# EAGLE design InterlockAdapter (EAGLE 6.4)
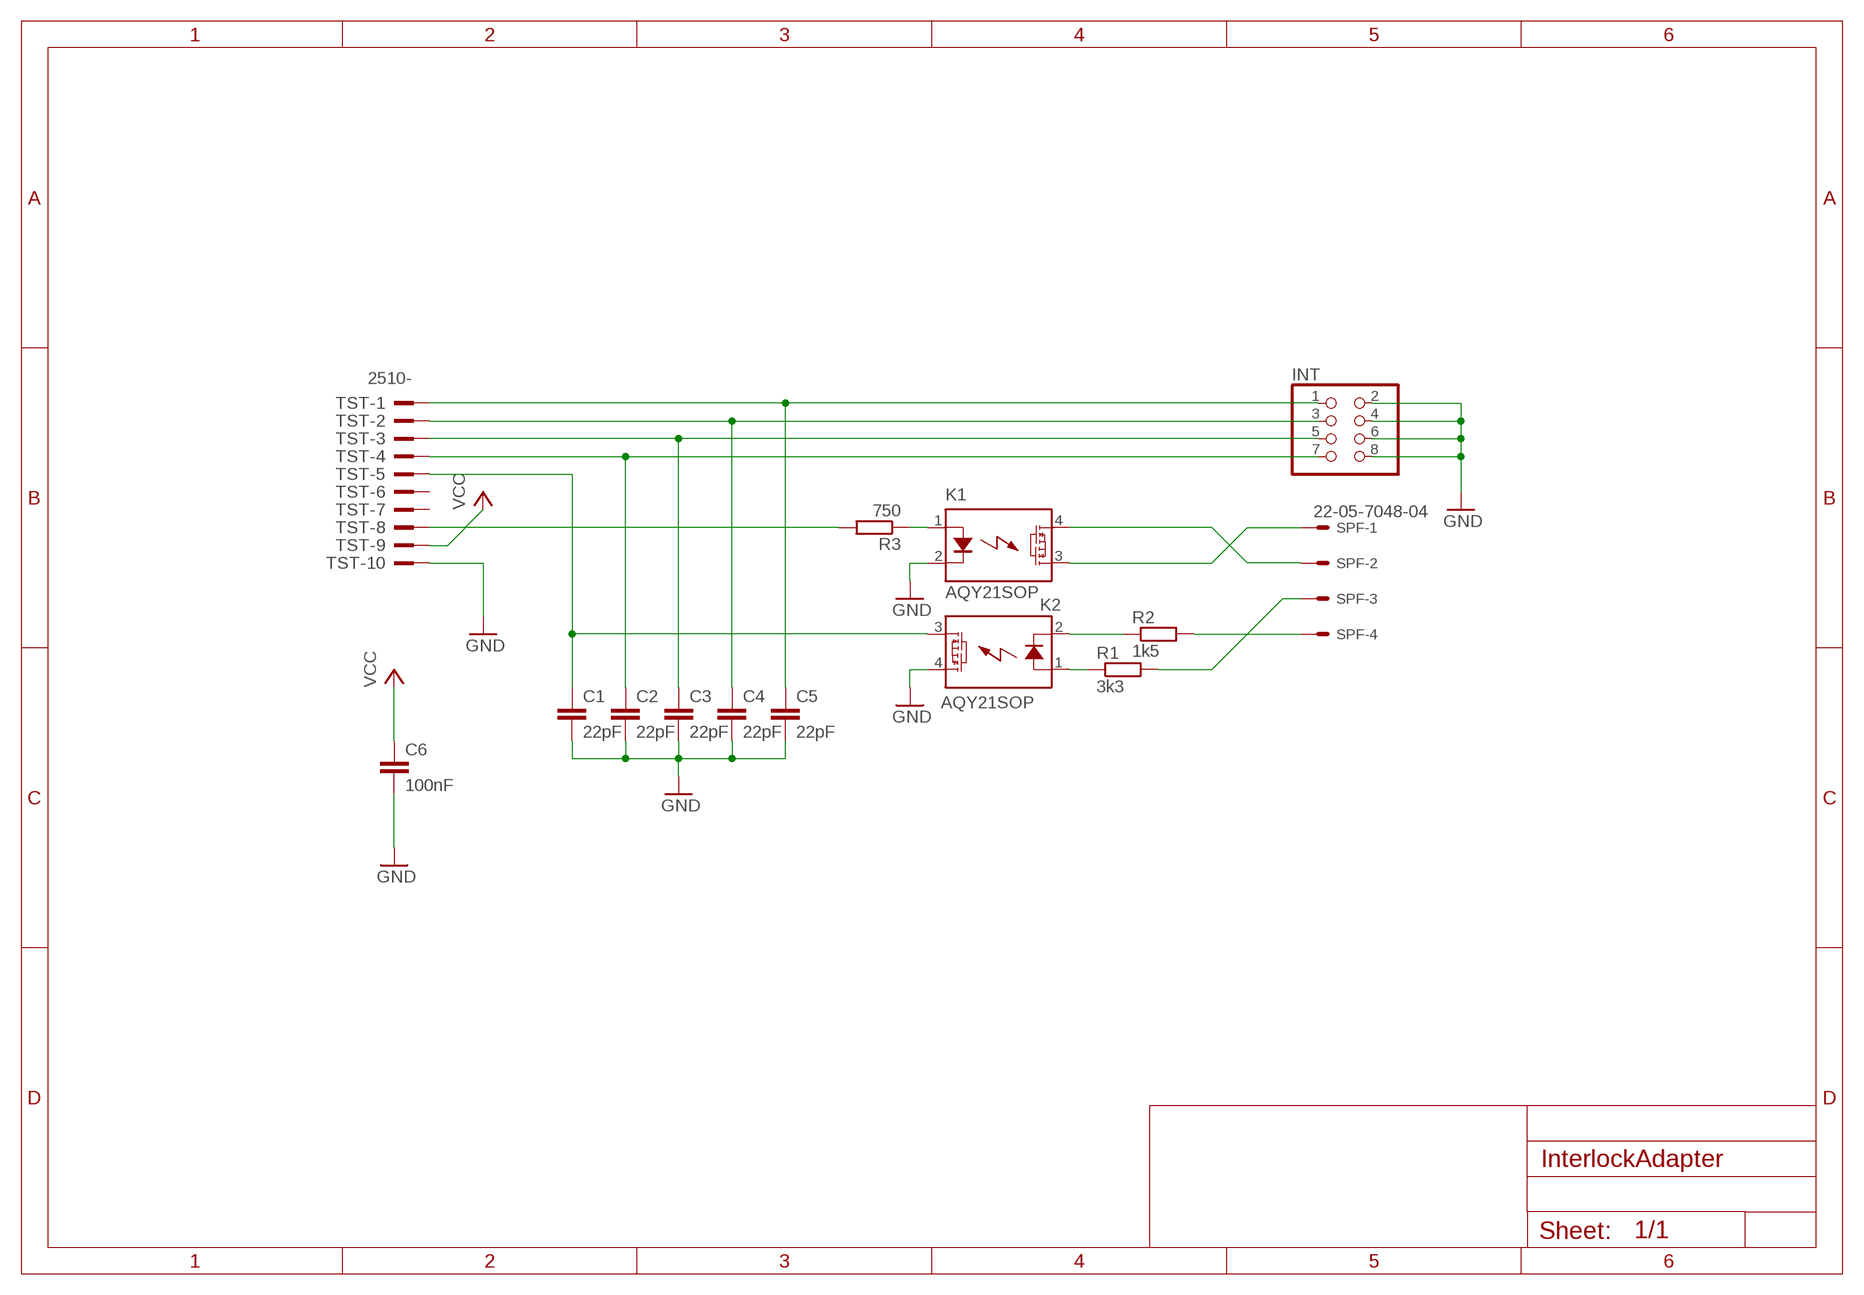
[diagram p0: schematic, sheet 1]

## Parts
C1  22pF  C-EUC1206K  [C1206K]
C2  22pF  C-EUC1206K  [C1206K]
C3  22pF  C-EUC1206K  [C1206K]
C4  22pF  C-EUC1206K  [C1206K]
C5  22pF  C-EUC1206K  [C1206K]
C6  100nF  C-EUC1206K  [C1206K]
INT  PINHD-2X4/90  [2X04/90]
K1  AQY21SOP  [SOP04]
K2  AQY21SOP  [SOP04]
R1  3k3  R-EU_R1206  [R1206]
R2  1k5  R-EU_R1206  [R1206]
R3  750  R-EU_R1206  [R1206]
SPF  22-05-7048-04  [7395-04]
TST  2510-  [PAK100/2500-10]

## Nets
GND: C1.2 C2.2 C3.2 C4.2 C5.2 C6.2 INT.2 INT.4 INT.6 INT.8 K1.2(K) K2.4(DS1) TST.10
N$1: C5.1 INT.1 TST.1
N$2: C4.1 INT.3 TST.2
N$3: C3.1 INT.5 TST.3
N$4: C2.1 INT.7 TST.4
N$5: C1.1 K2.3(DS2) TST.5
N$6: K2.2(K) R2.1
N$7: K2.1(A) R1.1
N$8: K1.3(DS2) SPF.1
N$9: K1.4(DS1) SPF.2
N$10: R2.2 SPF.4
N$11: R1.2 SPF.3
N$12: K1.1(A) R3.1
N$13: R3.2 TST.8
VCC: C6.1 TST.9
Unconnected: TST.6 TST.7

## Library data of the parts
C1-C6 = rcl:C-EU: CAPACITOR, European symbol
INT = pinhead:PINHD-2X4: PIN HEADER
K1 K2 = relay:AQY*: PhotoMOS Relay NAiS Source: http://www.panasonic-electric-works.com/catalogues/downloads/photomos/ds_x615_en_aqz10_20.pdf; OC_FARNELL: unknown; OC_NEWARK: unknown
R1-R3 = rcl:R-EU_: RESISTOR, European symbol
SPF = con-molex:22-?-04: CONNECTOR wire to board 2.54 mm (.1 inch) pitch header; OC_FARNELL: unknown; OC_NEWARK: unknown
TST = con-3m:2510-: 3M (TM) Pak 100 4-Wall Header Source: 3M; MF: 3M; MPN: 2510-6002UB; OC_FARNELL: 9838244; OC_NEWARK: 46F4725

## Board
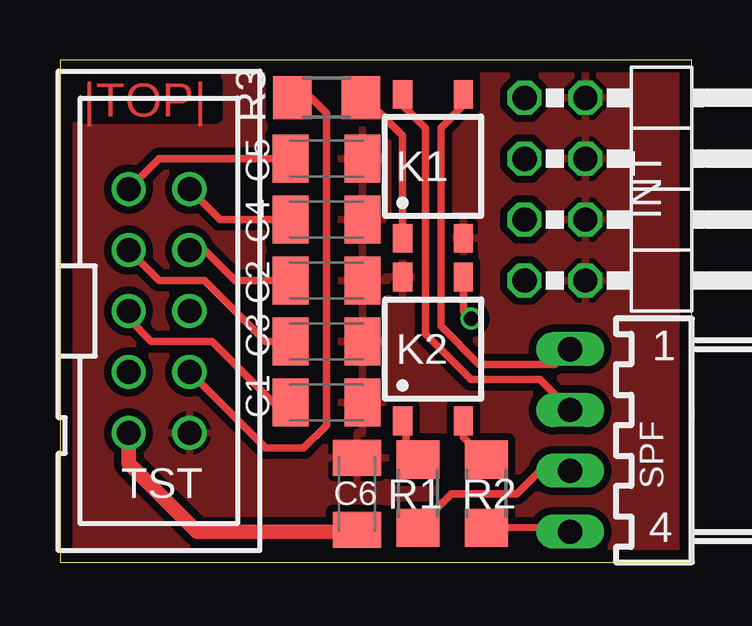
[diagram p1: board, top side]
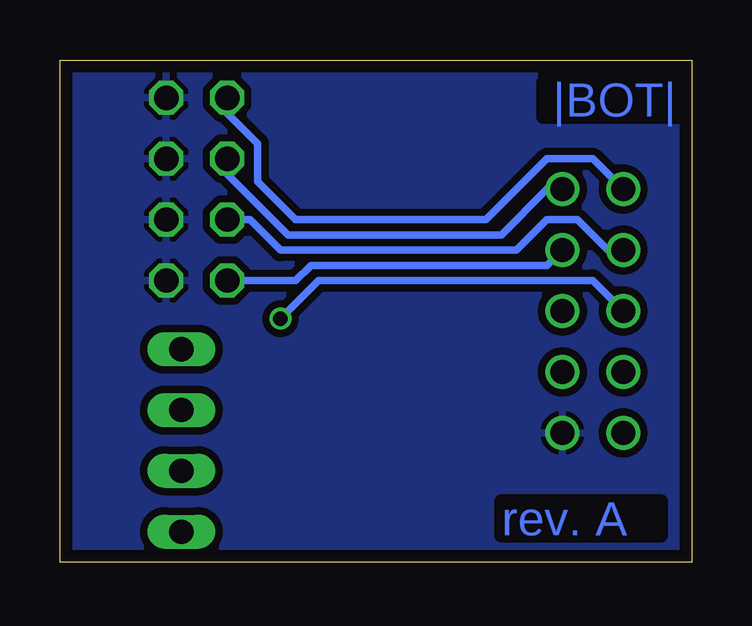
[diagram p2: board, bottom side, seen from below]

Size 26.34 x 20.95 mm. Coordinates in mm from the lower left corner, seen from the top.
Outline: 0,0 26.34,0 26.34,20.95 0,20.95 0,0
Copper layers (1*16): Top 0.035mm / dielectric 1.5mm / Bottom 0.035mm
Design rules "multi-cb_035um-cu": minimum track width 6mil, minimum drill 12mil, track to track 6mil, track to pad 6mil, pad to pad 6mil, via to via 6mil, smd to smd 6mil, copper to edge 20mil, drill to drill 8mil, minimum pad ring 8mil, minimum via ring 6mil, stop-mask expansion 3mil, vias tented up to drill 0mil, thermal gap 8mil

### Footprints (pad centres in the part's own frame; a part is rotated, then mirrored left to right if it is on the bottom)
C1206K = smd 1.5 x 2: 1 -1.5,0; 2 1.5,0
2X04/90 = drill 1.016 octagon: 1 -3.81,-6.35; 2 -3.81,-3.81; 3 -1.27,-6.35; 4 -1.27,-3.81; 5 1.27,-6.35; 6 1.27,-3.81; 7 3.81,-6.35; 8 3.81,-3.81
SOP04 = smd 0.8 x 1.2: 1 -1.27,-3; 2 1.27,-3; 3 1.27,3; 4 -1.27,3
R1206 = smd 1.6 x 1.803: 1 -1.422,0; 2 1.422,0
7395-04 = drill 1.016 long: 1 3.81,0; 2 1.27,0; 3 -1.27,0; 4 -3.81,0
PAK100/2500-10 = drill 1 pad 1.422: 1 -5.08,-1.27; 2 -5.08,1.27; 3 -2.54,-1.27; 4 -2.54,1.27; 5 0,-1.27; 6 0,1.27; 7 2.54,-1.27; 8 2.54,1.27; 9 5.08,-1.27; 10 5.08,1.27

### Placement (x,y rotation side)
C1  11.11,6.67 0 top
C2  11.11,11.75 0 top
C3  11.11,9.21 0 top
C4  11.11,14.29 0 top
C5  11.11,16.83 0 top
C6  12.38,2.86 90 top
INT  25.72,15.56 270 top
K1  15.56,16.51 0 top
K2  15.56,8.89 0 top
R1  14.92,2.86 270 top
R2  17.78,2.86 270 top
R3  11.11,19.37 180 top
SPF  21.27,5.08 90 top
TST  4.13,10.48 270 top

### Tracks (layer width: path | path; a pad name or v marks a point on that pad's centre or on a via)
GND
  pour Top (isolate 0.305): 0.64,20.64 26.04,20.64 26.04,0.32 0.32,0.32 0.32,20.64
  pour Bottom (isolate 0.305): 0.32,20.64 26.04,20.64 26.04,0.32 0.32,0.32
N$1
  Top 0.305: C5.1 4.13,16.83 TST.1
  Bottom 0.305: INT.1 19.37,18.73 18.1,17.46 18.1,15.88 16.51,14.29 8.57,14.29 6.03,16.83 4.13,16.83 TST.1
N$2
  Top 0.305: C4.1 6.67,14.29 TST.2
  Bottom 0.305: INT.3 19.37,16.19 16.83,13.65 7.94,13.65 6.03,15.56 TST.2
N$3
  Top 0.305: C3.1 8.57,9.21 6.03,11.75 4.13,11.75 TST.3
  Bottom 0.305: TST.3 3.49,13.02 4.76,14.29 6.03,14.29 7.3,13.02 17.14,13.02 18.41,14.29 INT.5
N$4
  Top 0.305: C2.1 7.3,11.75 6.03,13.02 TST.4
  Bottom 0.305: INT.7 16.51,11.75 15.88,12.38 6.03,12.38 TST.4
N$5  (via drill 0.6)
  Top 0.305: TST.5 2.86,10.16 3.81,9.21 6.35,9.21 8.89,6.67 C1.1 | K2.3 16.83,10.48 v17.14,10.16
  Bottom 0.305: v17.14,10.16 15.56,11.75 4.13,11.75 TST.5
N$6
  Top 0.305: K2.2 16.83,5.21 R2.1
N$7
  Top 0.305: K2.1 14.43,5.89 14.43,4.75 R1.1
N$8
  Top 0.305: K1.3 16.83,19.05 15.88,18.1 15.88,9.84 17.46,8.26 20.64,8.26 SPF.1
N$9
  Top 0.305: K1.4 14.29,19.05 15.24,18.1 15.24,9.53 17.14,7.62 20,7.62 SPF.2
N$10
  Top 0.305: R2.2 21.09,1.46 SPF.4
N$11
  Top 0.305: SPF.3 20,3.81 19.05,2.86 16.32,2.86 R1.2
N$12
  Top 0.305: R3.1 12.7,19.37 14.29,17.78 K1.1
N$13
  Top 0.305: R3.2 10.48,19.37 11.11,18.73 11.11,5.71 10.16,4.76 8.57,4.76 TST.8
VCC
  Top 0.61: TST.9 2.86,4.13 5.71,1.27 12.29,1.27 C6.1

### Text on the board
Top: |TOP|
Bottom: |BOT| | rev. A